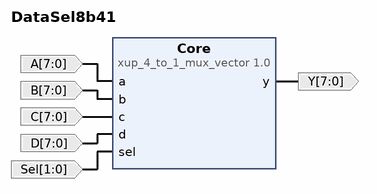
[diagram p0: block diagram of the top level]
# Vivado block design DataSel8b41, xc7a35tcpg236-1, Vivado 2017.2
create_bd_design DataSel8b41

create_bd_port -dir I -from 1 -to 0 Sel
create_bd_port -dir I -from 7 -to 0 A
create_bd_port -dir I -from 7 -to 0 B
create_bd_port -dir I -from 7 -to 0 C
create_bd_port -dir I -from 7 -to 0 D
create_bd_port -dir O -from 7 -to 0 Y

create_bd_cell -type ip -vlnv xilinx.com:xup:xup_4_to_1_mux_vector:1.0 Core
set_property -dict {CONFIG.SIZE 8} [get_bd_cells Core]

# ---- connections ----

connect_bd_net [get_bd_ports A] [get_bd_pins Core/a]
connect_bd_net [get_bd_ports B] [get_bd_pins Core/b]
connect_bd_net [get_bd_ports C] [get_bd_pins Core/c]
connect_bd_net [get_bd_ports D] [get_bd_pins Core/d]
connect_bd_net [get_bd_ports Sel] [get_bd_pins Core/sel]
connect_bd_net [get_bd_pins Core/y] [get_bd_ports Y]

validate_bd_design
save_bd_design
